# Altium schematic sheet [2] BlockDiagram.SchDoc: =DocumentName
size A3; Organization: ORGANIZATION; Address1: R. Aprígio Veloso, 882, Universitário; Address2: Campina Grande - PB; Address3: 58429-900; DocumentNumber: 2; Revision: -; SheetNumber: 2; SheetTotal: 8; ENG_DATE: --/--/--; DSN_DATE: --/--/--; CHK_DATE: --/--/--; SCH_SCALE: 1:1
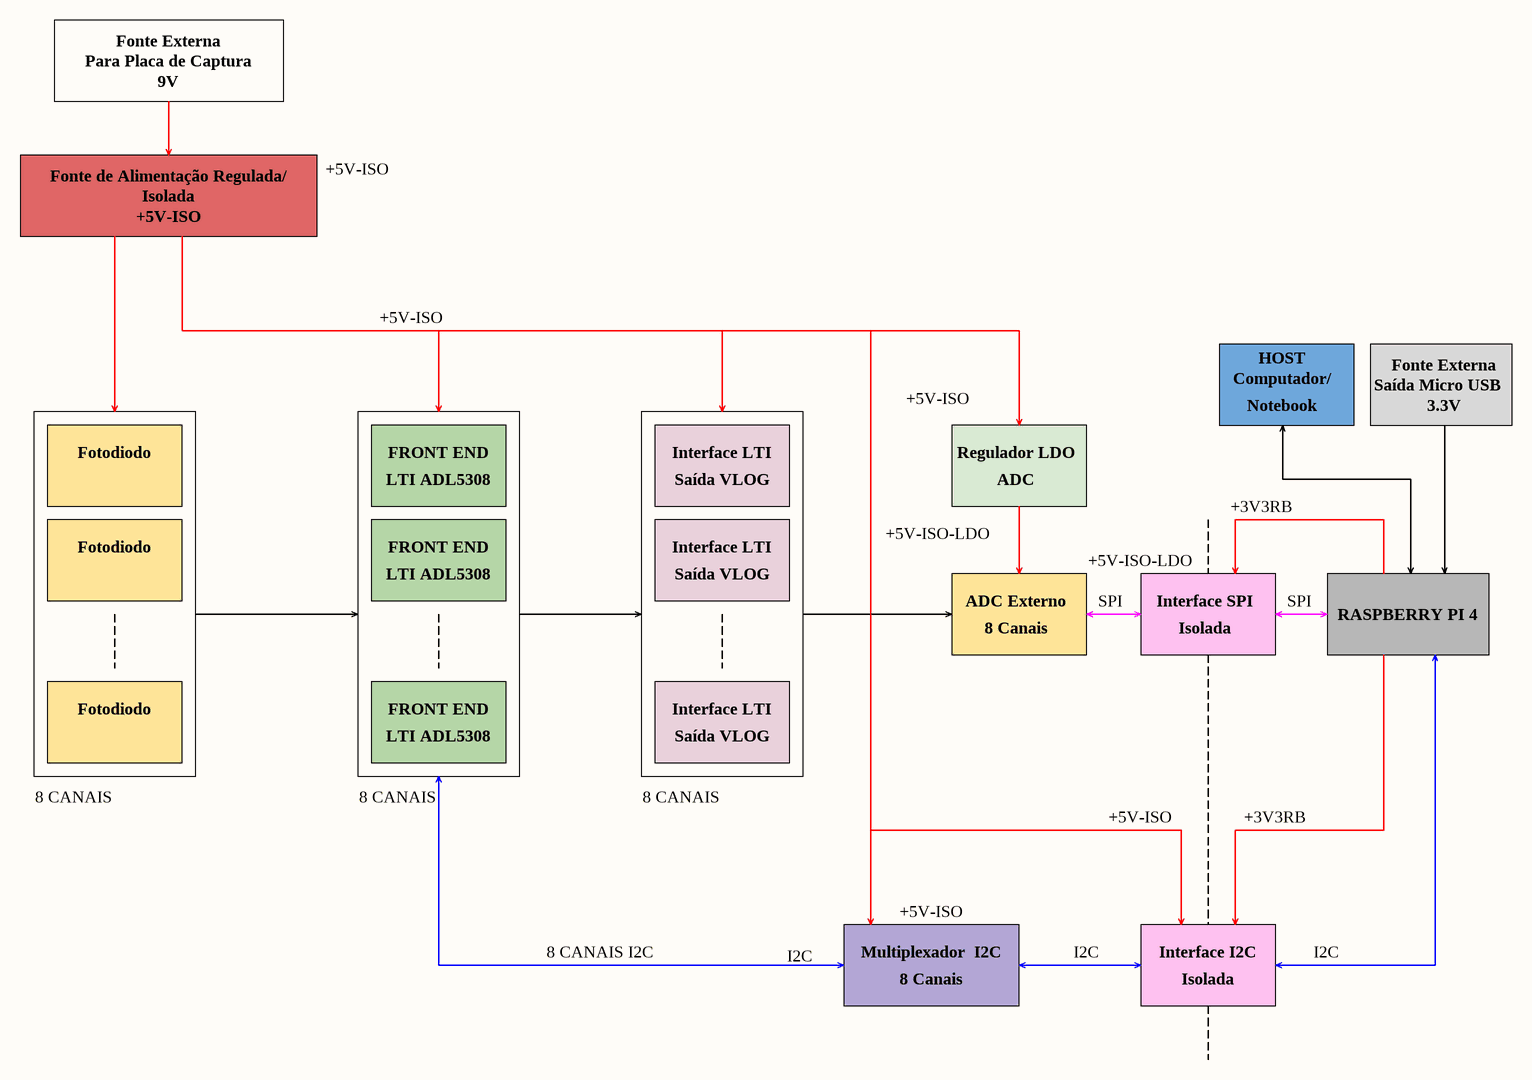
[diagram p0: [2] BlockDiagram.SchDoc]

## Notes on the sheet
- Fonte Externa
- Para Placa de Captura
- 9V
- Fonte de Alimentação Regulada/
- Isolada
- +5V-ISO
- HOST
- Computador/
- Notebook
- Saída Micro USB
- 3.3V
- Fotodiodo
- FRONT END
- LTI ADL5308
- Interface LTI
- Saída VLOG
- Regulador LDO
- ADC
- +5V-ISO-LDO
- +3V3RB
- ADC Externo
- SPI
- Interface SPI
- RASPBERRY PI 4
- 8 Canais
- 8 CANAIS
- 8 CANAIS I2C
- I2C
- Multiplexador  I2C
- Interface I2C
- REVISION
- DESCRIPTION
- DATE
- APPROVED
- ADDRESS
- PROJECT
- VERSION
- TITLE
- A3
- SIZE
- SCALE
- DOCUMENT NAME:
- DOCUMENT REVISION:
- OF
- SHEET:
- PROJECT REVISION: